# EAGLE design adc (EAGLE 9.6.2)
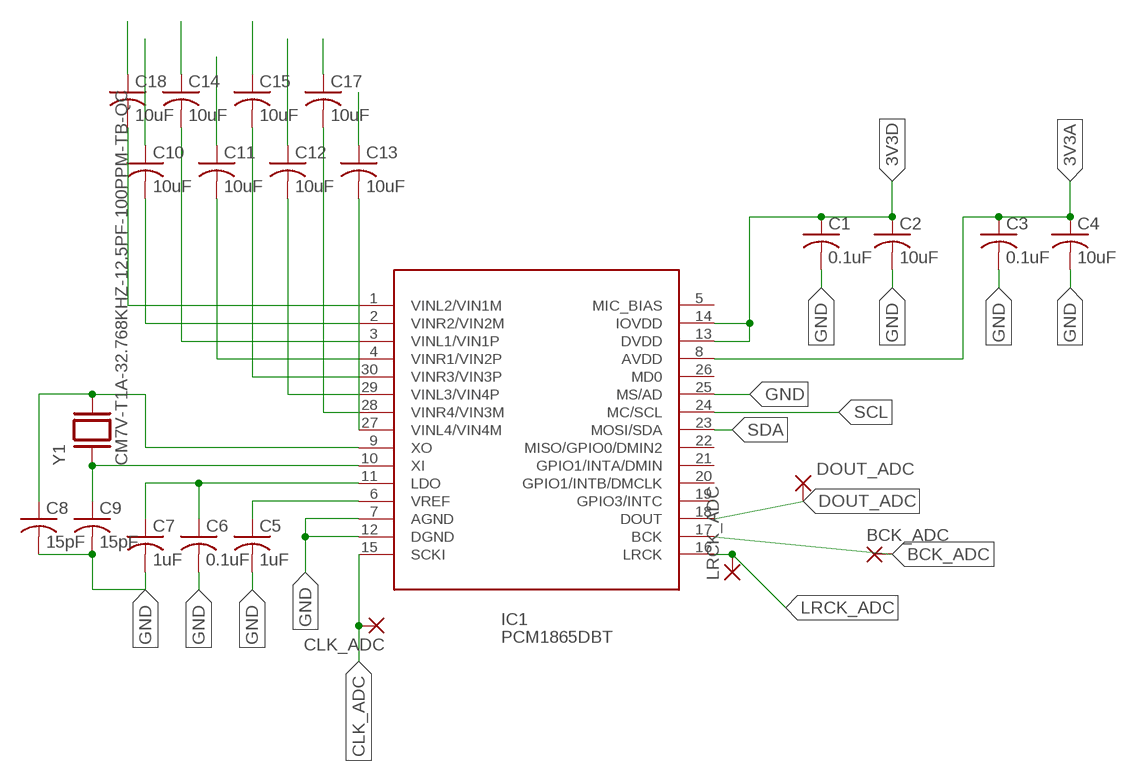
[diagram p0: schematic, sheet 1]

## Parts
BCK_ADC  SMD2  [SMD1,27-2,54]
C1  0.1uF  C-USC0402  [C0402]
C2  10uF  C-USC0402  [C0402]
C3  0.1uF  C-USC0402  [C0402]
C4  10uF  C-USC0402  [C0402]
C5  1uF  C-USC0402  [C0402]
C6  0.1uF  C-USC0402  [C0402]
C7  1uF  C-USC0402  [C0402]
C8  15pF  C-USC0402  [C0402]
C9  15pF  C-USC0402  [C0402]
C10  10uF  C-USC0402  [C0402]
C11  10uF  C-USC0402  [C0402]
C12  10uF  C-USC0402  [C0402]
C13  10uF  C-USC0402  [C0402]
C14  10uF  C-USC0402  [C0402]
C15  10uF  C-USC0402  [C0402]
C17  10uF  C-USC0402  [C0402]
C18  10uF  C-USC0402  [C0402]
CLK_ADC  SMD2  [SMD1,27-2,54]
DOUT_ADC  SMD2  [SMD1,27-2,54]
IC1  PCM1865DBT  [TSSOP-30]
LRCK_ADC  SMD2  [SMD1,27-2,54]
Y1  CM7V-T1A-32.768KHZ-12.5PF-100PPM-TB-QC  [XTAL_CM7V-T1A-32.768KHZ-12.5PF-100PPM-TB-QC]

## Nets
3V3A: C3.1 C4.1 IC1.8(AVDD)
3V3D: C1.1 C2.1 IC1.13(DVDD) IC1.14(IOVDD)
BCK_ADC: BCK_ADC.1(P) IC1.17(BCK)
CLK_ADC: CLK_ADC.1(P) IC1.15(SCKI)
DOUT_ADC: DOUT_ADC.1(P) IC1.18(DOUT)
GND: C1.2 C2.2 C3.2 C4.2 C5.2 C6.2 C7.2 C8.2 C9.2 IC1.7(AGND) IC1.12(DGND) IC1.25(MS/AD)
LRCK_ADC: IC1.16(LRCK) LRCK_ADC.1(P)
N$1: C8.1 IC1.9(XO) Y1.2
N$2: C9.1 IC1.10(XI) Y1.1
N$3: C15.1
N$4: C12.1
N$5: C18.2 IC1.1(VINL2/VIN1M)
N$6: C10.2 IC1.2(VINR2/VIN2M)
N$7: C14.2 IC1.3(VINL1/VIN1P)
N$8: C11.2 IC1.4(VINR1/VIN2P)
N$9: C12.2 IC1.29(VINL3/VIN4P)
N$10: C5.1 IC1.6(VREF)
N$11: C6.1 C7.1 IC1.11(LDO)
N$12: C17.2 IC1.28(VINR4/VIN3M)
N$13: C13.2 IC1.27(VINL4/VIN4M)
N$14: C17.1
N$15: C13.1
N$17: C11.1
N$18: C14.1
N$19: C10.1
N$20: C18.1
N$21: C15.2 IC1.30(VINR3/VIN3P)
SCL: IC1.24(MC/SCL)
SDA: IC1.23(MOSI/SDA)
Unconnected: IC1.5(MIC_BIAS) IC1.19(GPIO3/INTC) IC1.20(GPIO1/INTB/DMCLK) IC1.21(GPIO1/INTA/DMIN) IC1.22(MISO/GPIO0/DMIN2) IC1.26(MD0)

## Library data of the parts
BCK_ADC CLK_ADC DOUT_ADC LRCK_ADC = wirepad:SMD2: SMD PAD
C1-C15 C17 C18 = rcl:C-US: CAPACITOR, American symbol; SPICEPREFIX: C
IC1 = PCM1865DBT:PCM1865DBT: CS item no.: CS description: PCM186x 4-Channel or 2-Channel, 192-kHz, Audio ADCs Specification: http://www.ti.com Check availability <https://pricing.snapeda.com/parts/PCM1865DBT/Texas%20Instruments/view-part?ref=eda>; AVAILABILITY: In Stock; CHECK_PRICES: https://www.snapeda.com/parts/PCM1865DBT/Texas+Instruments/view-part/?ref=eda; DESCRIPTION: 110dB 4-Channel Software-Controlled Audio ADC With Universal Front End; MF: Texas Instruments; MP: PCM1865DBT; PACKAGE: TSSOP-30 Texas Instruments; PRICE: None; PURCHASE-URL: https://www.snapeda.com/api/url_track_click_mouser/?unipart_id=554870&manufacturer=Texas Instruments&part_name=PCM1865DBT&search_term=pcm186; SNAPEDA_LINK: https://www.snapeda.com/parts/PCM1865DBT/Texas+Instruments/view-part/?ref=snap
Y1 = CM7V-T1A-32.768KHZ-12.5PF-100PPM-TB-QC:CM7V-T1A-32.768KHZ-12.5PF-100PPM-TB-QC: Check availability <https://pricing.snapeda.com/parts/CM7V-T1A-32.768kHz-12.5pF-100PPM-TB-QC/Micro%20Crystal/view-part?ref=eda>; AVAILABILITY: In Stock; CHECK_PRICES: https://www.snapeda.com/parts/CM7V-T1A-32.768kHz-12.5pF-100PPM-TB-QC/Micro+Crystal/view-part/?ref=eda; DESCRIPTION: Tuning Fork Crystal 32.768kHz in SMD 1.5 x 3.2 mm package; MF: Micro Crystal; MP: CM7V-T1A-32.768kHz-12.5pF-100PPM-TB-QC; PACKAGE: SMD-2 Micro Crystal; PRICE: None; PURCHASE-URL: https://www.snapeda.com/api/url_track_click_mouser/?unipart_id=4216772&manufacturer=Micro Crystal&part_name=CM7V-T1A-32.768kHz-12.5pF-100PPM-TB-QC&search_term=None; SNAPEDA_LINK: https://www.snapeda.com/parts/CM7V-T1A-32.768kHz-12.5pF-100PPM-TB-QC/Micro+Crystal/view-part/?ref=snap

## Board
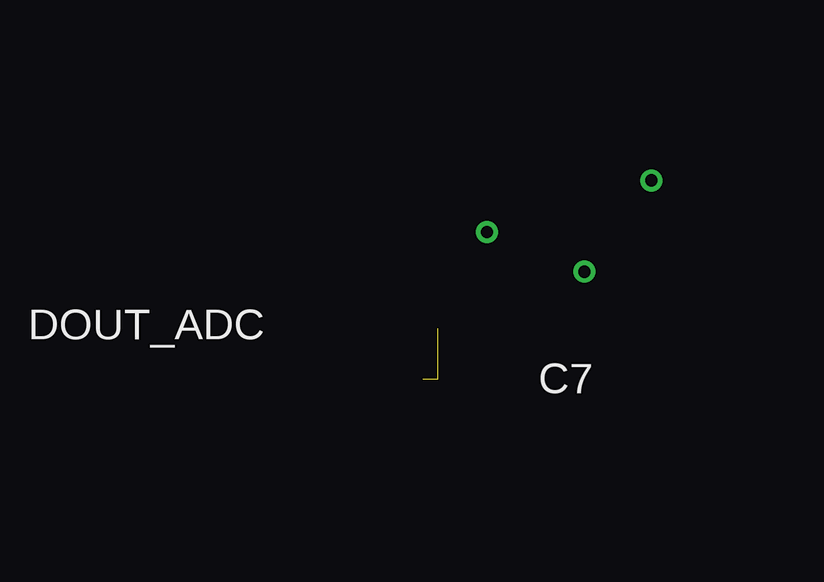
[diagram p1: board, top side]
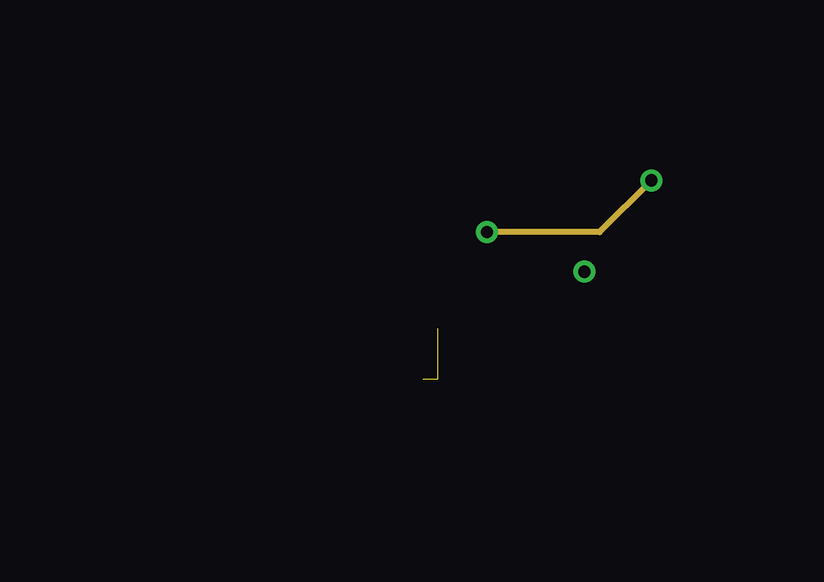
[diagram p2: board, inner layer Route2]
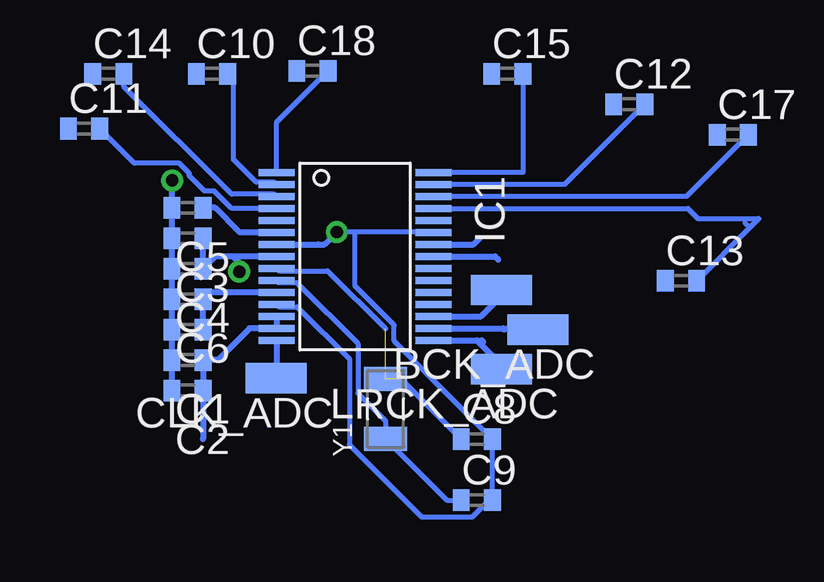
[diagram p3: board, bottom side, seen from below]

No outline drawn. Coordinates in mm, seen from the top.
Copper layers (1+2*15+16): Top 0.035mm / dielectric 1.5mm / Route2 0.035mm / dielectric 0.15mm / Route15 0.035mm / dielectric 0.2mm / Bottom 0.035mm
Design rules "default *": minimum track width 6mil, minimum drill 0.35mm, track to track 6mil, track to pad 6mil, pad to pad 6mil, via to via 6mil, smd to smd 6mil, copper to edge 40mil, drill to drill 6mil, minimum pad ring 10mil, minimum via ring 8mil, stop-mask expansion 4mil, vias tented up to drill 0mil, thermal gap 10mil

### Footprints (pad centres in the part's own frame; a part is rotated, then mirrored left to right if it is on the bottom)
SMD1,27-2,54 = smd 1.27 x 2.54: 1 0,0
C0402 = smd 0.7 x 0.9: 1 -0.65,0; 2 0.65,0
TSSOP-30 = smd 0.3 x 1.5: 1 -3.5,-3.27; 2 -3,-3.27; 3 -2.5,-3.27; 4 -2,-3.27; 5 -1.5,-3.27; 6 -1,-3.27; 7 -0.5,-3.27; 8 0,-3.27; 9 0.5,-3.27; 10 1,-3.27; 11 1.5,-3.27; 12 2,-3.27; 13 2.5,-3.27; 14 3,-3.27; 15 3.5,-3.27; 16 3.5,3.27; 17 3,3.27; 18 2.5,3.27; 19 2,3.27; 20 1.5,3.27; 21 1,3.27; 22 0.5,3.27; 23 0,3.27; 24 -0.5,3.27; 25 -1,3.27; 26 -1.5,3.27; 27 -2,3.27; 28 -2.5,3.27; 29 -3,3.27; 30 -3.5,3.27
XTAL_CM7V-T1A-32.768KHZ-12.5PF-100PPM-TB-QC = smd 1 x 1.8: 1 -1.25,0; 2 1.25,0

### Placement (x,y rotation side)
BCK_ADC  5.08,16 90 bottom
C1  19.68,14.73 180 bottom
C2  19.68,13.46 180 bottom
C3  19.68,19.81 180 bottom
C4  19.68,18.54 180 bottom
C5  19.68,21.08 180 bottom
C6  19.68,17.27 180 bottom
C7  19.68,16 180 bottom
C8  7.62,11.43 0 bottom
C9  7.62,8.89 0 bottom
C10  18.67,26.67 0 bottom
C11  24,24.38 0 bottom
C12  1.27,25.4 0 bottom
C13  -0.89,18.03 0 bottom
C14  22.99,26.67 0 bottom
C15  6.35,26.67 0 bottom
C17  -3.05,24.13 0 bottom
C18  14.48,26.8 0 bottom
CLK_ADC  16,13.97 90 bottom
DOUT_ADC  6.6,17.65 90 bottom
IC1  12.7,19.05 270 bottom
LRCK_ADC  6.6,14.35 90 bottom
Y1  11.43,12.7 90 bottom

### Tracks (layer width: path | path; a pad name or v marks a point on that pad's centre or on a via)
3V3A  (via drill 0.51)
  Bottom 0.254: IC1.8 17.78,19.05 | 17.78,19.05 18.53,19.05 C4.1 C3.1 | 17.78,19.05 17.53,18.8 v17.53,18.41
3V3D
  Bottom 0.254: IC1.13 IC1.14 17.1,16.05 18.41,14.73 C1.1 C2.1 19.04,11.45 19.05,11.43
BCK_ADC
  Bottom 0.254: IC1.17 6.53,16.05 | 6.53,16.05 6.48,16 | 6.53,16.05 5.13,16.05 BCK_ADC.1
CLK_ADC
  Bottom 0.254: IC1.15 15.97,14.13 | 15.97,14.13 16,14.1 | CLK_ADC.1 15.97,14 15.97,14.13
DOUT_ADC
  Bottom 0.254: IC1.18 7.45,16.55 7.37,16.64 6.6,17.4 DOUT_ADC.1
GND  (via drill 0.51)
  Route2 0.254: v20.32,22.23 18.16,20.07 v13.46,20.07
  Bottom 0.203: IC1.25 9.45,20.07 12.7,20.07 | 12.7,20.07 v13.46,20.07 | 12.7,20.07 12.7,17.81 11.07,16.19 11.07,15.53 C8.2 C9.2 7.11,8.89 7.82,8.19 9.93,8.19 12.94,11.2 12.94,14.78 15.12,16.95 15.87,16.95 IC1.12
  Bottom 0.254: IC1.7 14.23,19.55 | 14.23,19.55 14.22,19.56 | 14.22,19.54 14.23,19.55 | C2.2 C1.2 C7.2 C6.2 C4.2 C3.2 C5.2 20.32,21.1 v20.32,22.23 | 14.23,19.55 13.98,19.55 v13.46,20.07
LRCK_ADC
  Bottom 0.254: IC1.16 7.62,15.55 | 7.62,15.55 7.42,15.55 7.37,15.49 | 7.62,15.55 6.6,14.53 LRCK_ADC.1
N$1  (2 unrouted)
  Bottom 0.203: IC1.9 15.87,18.45 13.85,18.45 11.43,16.04 | 10.79,13.95 C8.1
N$2
  Bottom 0.203: IC1.10 15.87,17.95 15.12,17.95 12.58,15.42 12.58,13.35 11.43,12.19 Y1.1 8.87,8.89 C9.1
N$5
  Bottom 0.203: IC1.1 15.97,24.66 C18.2
N$6
  Bottom 0.203: C10.2 17.78,26.43 17.78,23.1 16.97,22.3 16.82,22.15 16.07,22.15 IC1.2
N$7
  Bottom 0.203: IC1.3 16.07,21.65 17.84,21.65 22.34,26.14 C14.2
N$8
  Bottom 0.203: IC1.4 17.84,21.05 18.58,21.79 18.98,21.79 19.61,22.42 19.61,22.52 20.02,22.94 21.91,22.94 C11.2
N$9
  Bottom 0.203: C12.2 3.97,22.05 IC1.29
N$10
  Bottom 0.254: IC1.6 17.51,20.05 18.54,21.08 C5.1
N$11
  Bottom 0.254: IC1.11 18.76,17.55 C6.1 C7.1
N$12
  Bottom 0.203: C17.2 -1.12,21.55 IC1.28
N$13
  Bottom 0.203: IC1.27 -1.18,21.05 -1.59,20.64 -4.13,20.64 -4.13,20.63 -3.75,20.25 | -3.75,20.25 -3.56,20.45 | C13.2 -3.75,20.25
N$21
  Bottom 0.203: C15.2 5.7,22.55 IC1.30
SCL
  Bottom 0.254: IC1.24 7.75,19.55 7.49,19.81
SDA
  Bottom 0.254: IC1.23 6.86,19.05 6.73,18.92